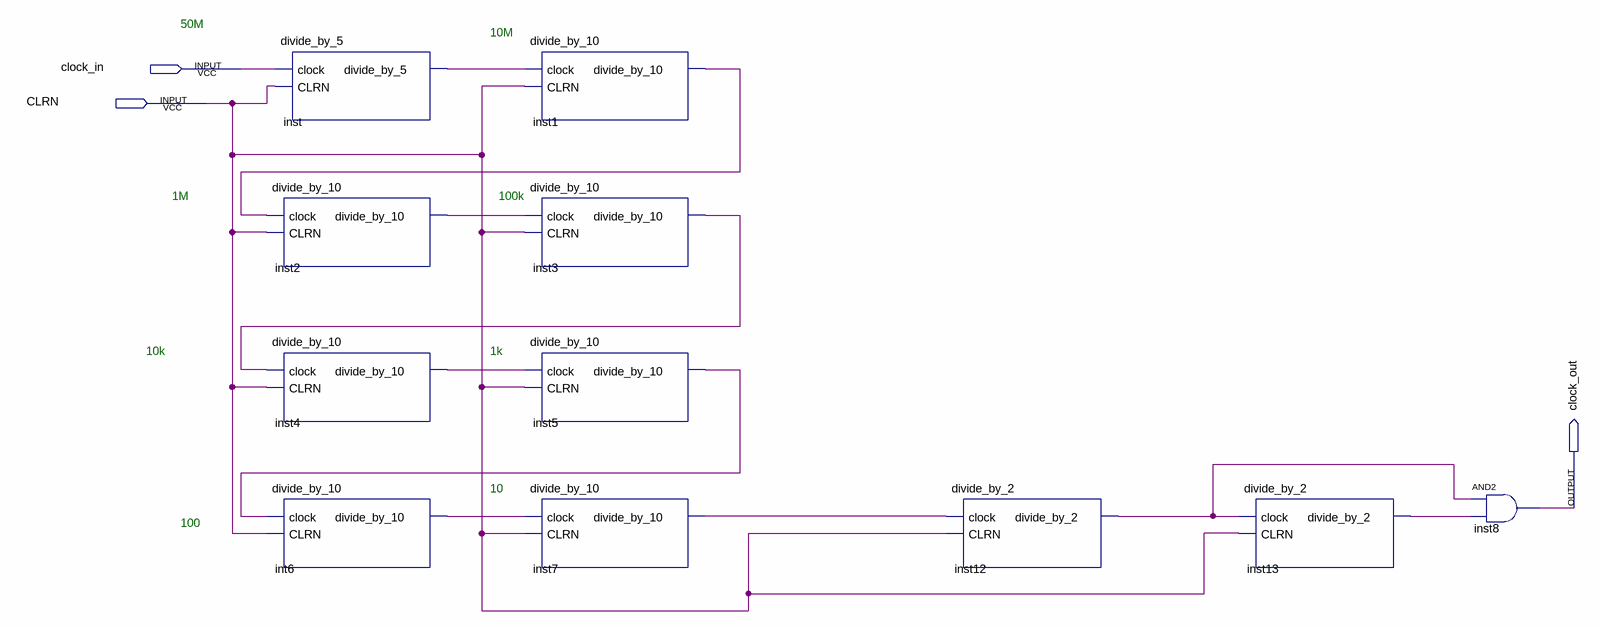
[diagram p0: schematic sheet]
// Quartus schematic clockGenerator.bdf as structural Verilog: 11 symbols, 3 pins
module clockGenerator (
  input  clock_in,
  input  CLRN,
  output clock_out
);

  wire inst1_divide_by_10, inst2_divide_by_10, inst3_divide_by_10, inst4_divide_by_10, inst5_divide_by_10,
       inst7_divide_by_10, inst12_divide_by_2, inst13_divide_by_2, inst_divide_by_5, int6_divide_by_10;

  divide_by_10 inst2 (.clock(inst1_divide_by_10), .CLRN(CLRN), .divide_by_10(inst2_divide_by_10));
  divide_by_10 inst4 (.clock(inst3_divide_by_10), .CLRN(CLRN), .divide_by_10(inst4_divide_by_10));
  divide_by_10 int6 (.clock(inst5_divide_by_10), .CLRN(CLRN), .divide_by_10(int6_divide_by_10));
  divide_by_5 inst (.clock(clock_in), .CLRN(CLRN), .divide_by_5(inst_divide_by_5));
  divide_by_10 inst1 (.clock(inst_divide_by_5), .CLRN(CLRN), .divide_by_10(inst1_divide_by_10));
  divide_by_10 inst3 (.clock(inst2_divide_by_10), .CLRN(CLRN), .divide_by_10(inst3_divide_by_10));
  divide_by_10 inst5 (.clock(inst4_divide_by_10), .CLRN(CLRN), .divide_by_10(inst5_divide_by_10));
  divide_by_10 inst7 (.clock(int6_divide_by_10), .CLRN(CLRN), .divide_by_10(inst7_divide_by_10));
  divide_by_2 inst12 (.clock(inst7_divide_by_10), .CLRN(CLRN), .divide_by_2(inst12_divide_by_2));
  divide_by_2 inst13 (.clock(inst12_divide_by_2), .CLRN(CLRN), .divide_by_2(inst13_divide_by_2));
  and inst8 (clock_out, inst12_divide_by_2, inst13_divide_by_2);

  // Notes on the sheet:
  //   50M
  //   10M
  //   1M
  //   100k
  //   10k
  //   1k
  //   10
  //   100
endmodule
